# Altium schematic sheet HorsPCB.SchDoc
size A4
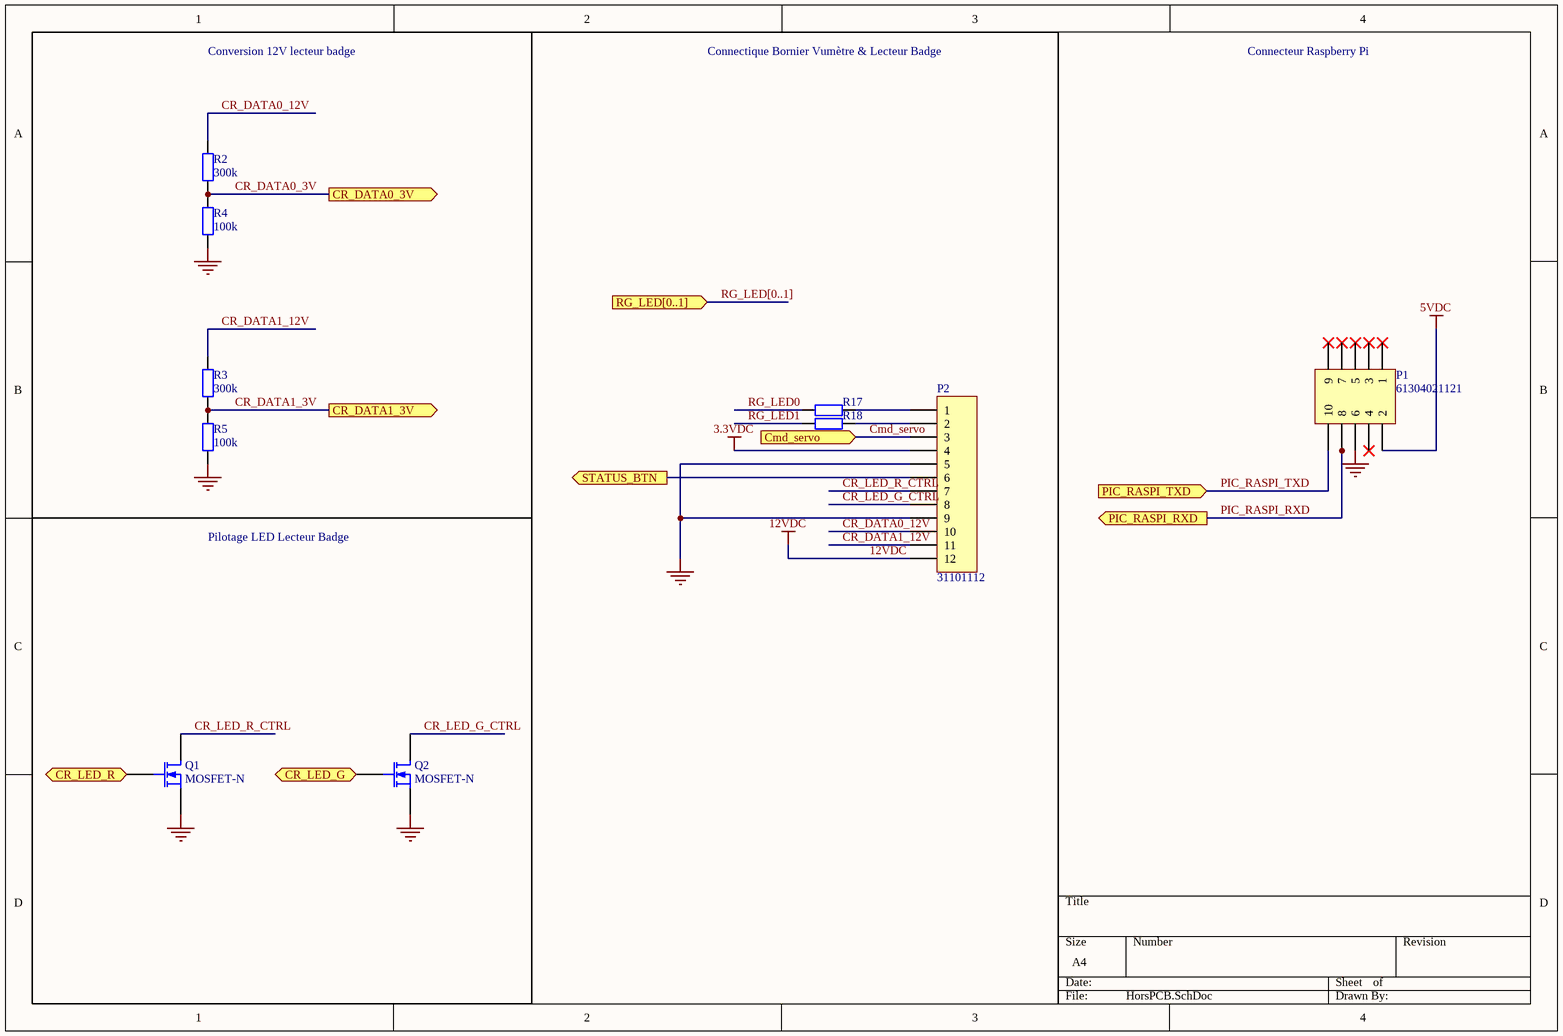
[diagram p0: HorsPCB.SchDoc]

## Parts
P1  61304021121  [HDR2X5]
P2  31101112  [Bornier12]
Q1  MOSFET-N  [nouveau_mosfetN]
Q2  MOSFET-N  [nouveau_mosfetN]
R2  300k  [0603]
R3  300k  [0603]
R4  100k  [0603]
R5  100k  [0603]
R17  60.4  [0603]  (value not drawn)
R18  75  [0603]  (value not drawn)

## Ports
Cmd_servo (in), CR_DATA0_3V (out), CR_DATA1_3V (out), CR_LED_G (in), CR_LED_R (in), PIC_RASPI_RXD (out), PIC_RASPI_TXD (in), RG_LED[0..1] (in), STATUS_BTN (out)

## Nets
3.3VDC: P2.4
5VDC: P1.2
12VDC: P2.12
GND: P1.6 P2.5 P2.9 Q1.3(S) Q2.3(S) R4.1 R5.1
Cmd_servo: P2.3 ; port Cmd_servo
CR_DATA0_3V: R2.1 R4.2 ; port CR_DATA0_3V
CR_DATA0_12V: P2.10 R2.2
CR_DATA1_3V: R3.1 R5.2 ; port CR_DATA1_3V
CR_DATA1_12V: P2.11 R3.2
CR_LED_G: Q2.2(G) ; port CR_LED_G
CR_LED_G_CTRL: P2.8 Q2.1(D)
CR_LED_R: Q1.2(G) ; port CR_LED_R
CR_LED_R_CTRL: P2.7 Q1.1(D)
PIC_RASPI_RXD: P1.8 ; port PIC_RASPI_RXD
PIC_RASPI_TXD: P1.10 ; port PIC_RASPI_TXD
RG_LED0: R17.1
RG_LED1: R18.1
STATUS_BTN: P2.6 ; port STATUS_BTN
NetP2_1: P2.1 R17.2
NetP2_2: P2.2 R18.2

Not connected (* = marked no-connect by the designer): P1 1* 3* 4* 5* 7* 9*

## Buses and harness runs
bus RG_LED[0..1] = port RG_LED[0..1]

## Notes on the sheet
- Conversion 12V lecteur badge
- Connectique Bornier Vumètre & Lecteur Badge
- Connecteur Raspberry Pi
- Pilotage LED Lecteur Badge

## Library data of the parts
P1 = Header 5X2: Header, 5-Pin, Dual row; Fournisseur: Farnell; Ref.Fournisseur: 2356148; Fabricant: WURTH ELEKTRONIK; Ref.Fabricant: 61304021121
P2 = Header 12: Header, 12-Pin; Fournisseur: Farnell; Fabricant: METZ CONNECT; Ref.Fournisseur: 1909750; Ref.Fabricant: 31101112
Q1 Q2 = MOSFET-N: N-Channel MOSFET; Fournisseur: Farnell; Ref.Fournisseur: 2727912; Fabricant: ON SEMICONDUCTOR; Ref.Fabricant: 1HN04CH-TL-W
R2 R3 = Res2: Resistor; Fournisseur: Farnell; Ref.Fournisseur: 2074433; Fabricant: MULTICOMP; Ref.Fabricant: MCSR08X3003FTL; Value: 300k
R4 R5 = Res2: Resistor; Fournisseur: Farnell; Ref.Fournisseur: 2447226; Fabricant: MULTICOMP; Ref.Fabricant: MCWR06X1003FTL; Value: 100k
R17 = Res2: Resistor; Value: 60.4o; Fournisseur: Farnell; Fabricant: TE CONNECTIVITY; Ref.Fabricant: RP73PF1E60R4BTDF; Ref.Fournisseur: 2838800
R18 = Res2: Resistor; Value: 75o; Fournisseur: Farnell; Fabricant: TE CONNECTIVITY; Ref.Fabricant: CPF0805B75RE1; Ref.Fournisseur: 1697415